# EAGLE design H0FR72 (EAGLE 9.6.1)

## Sheet 1 of 2
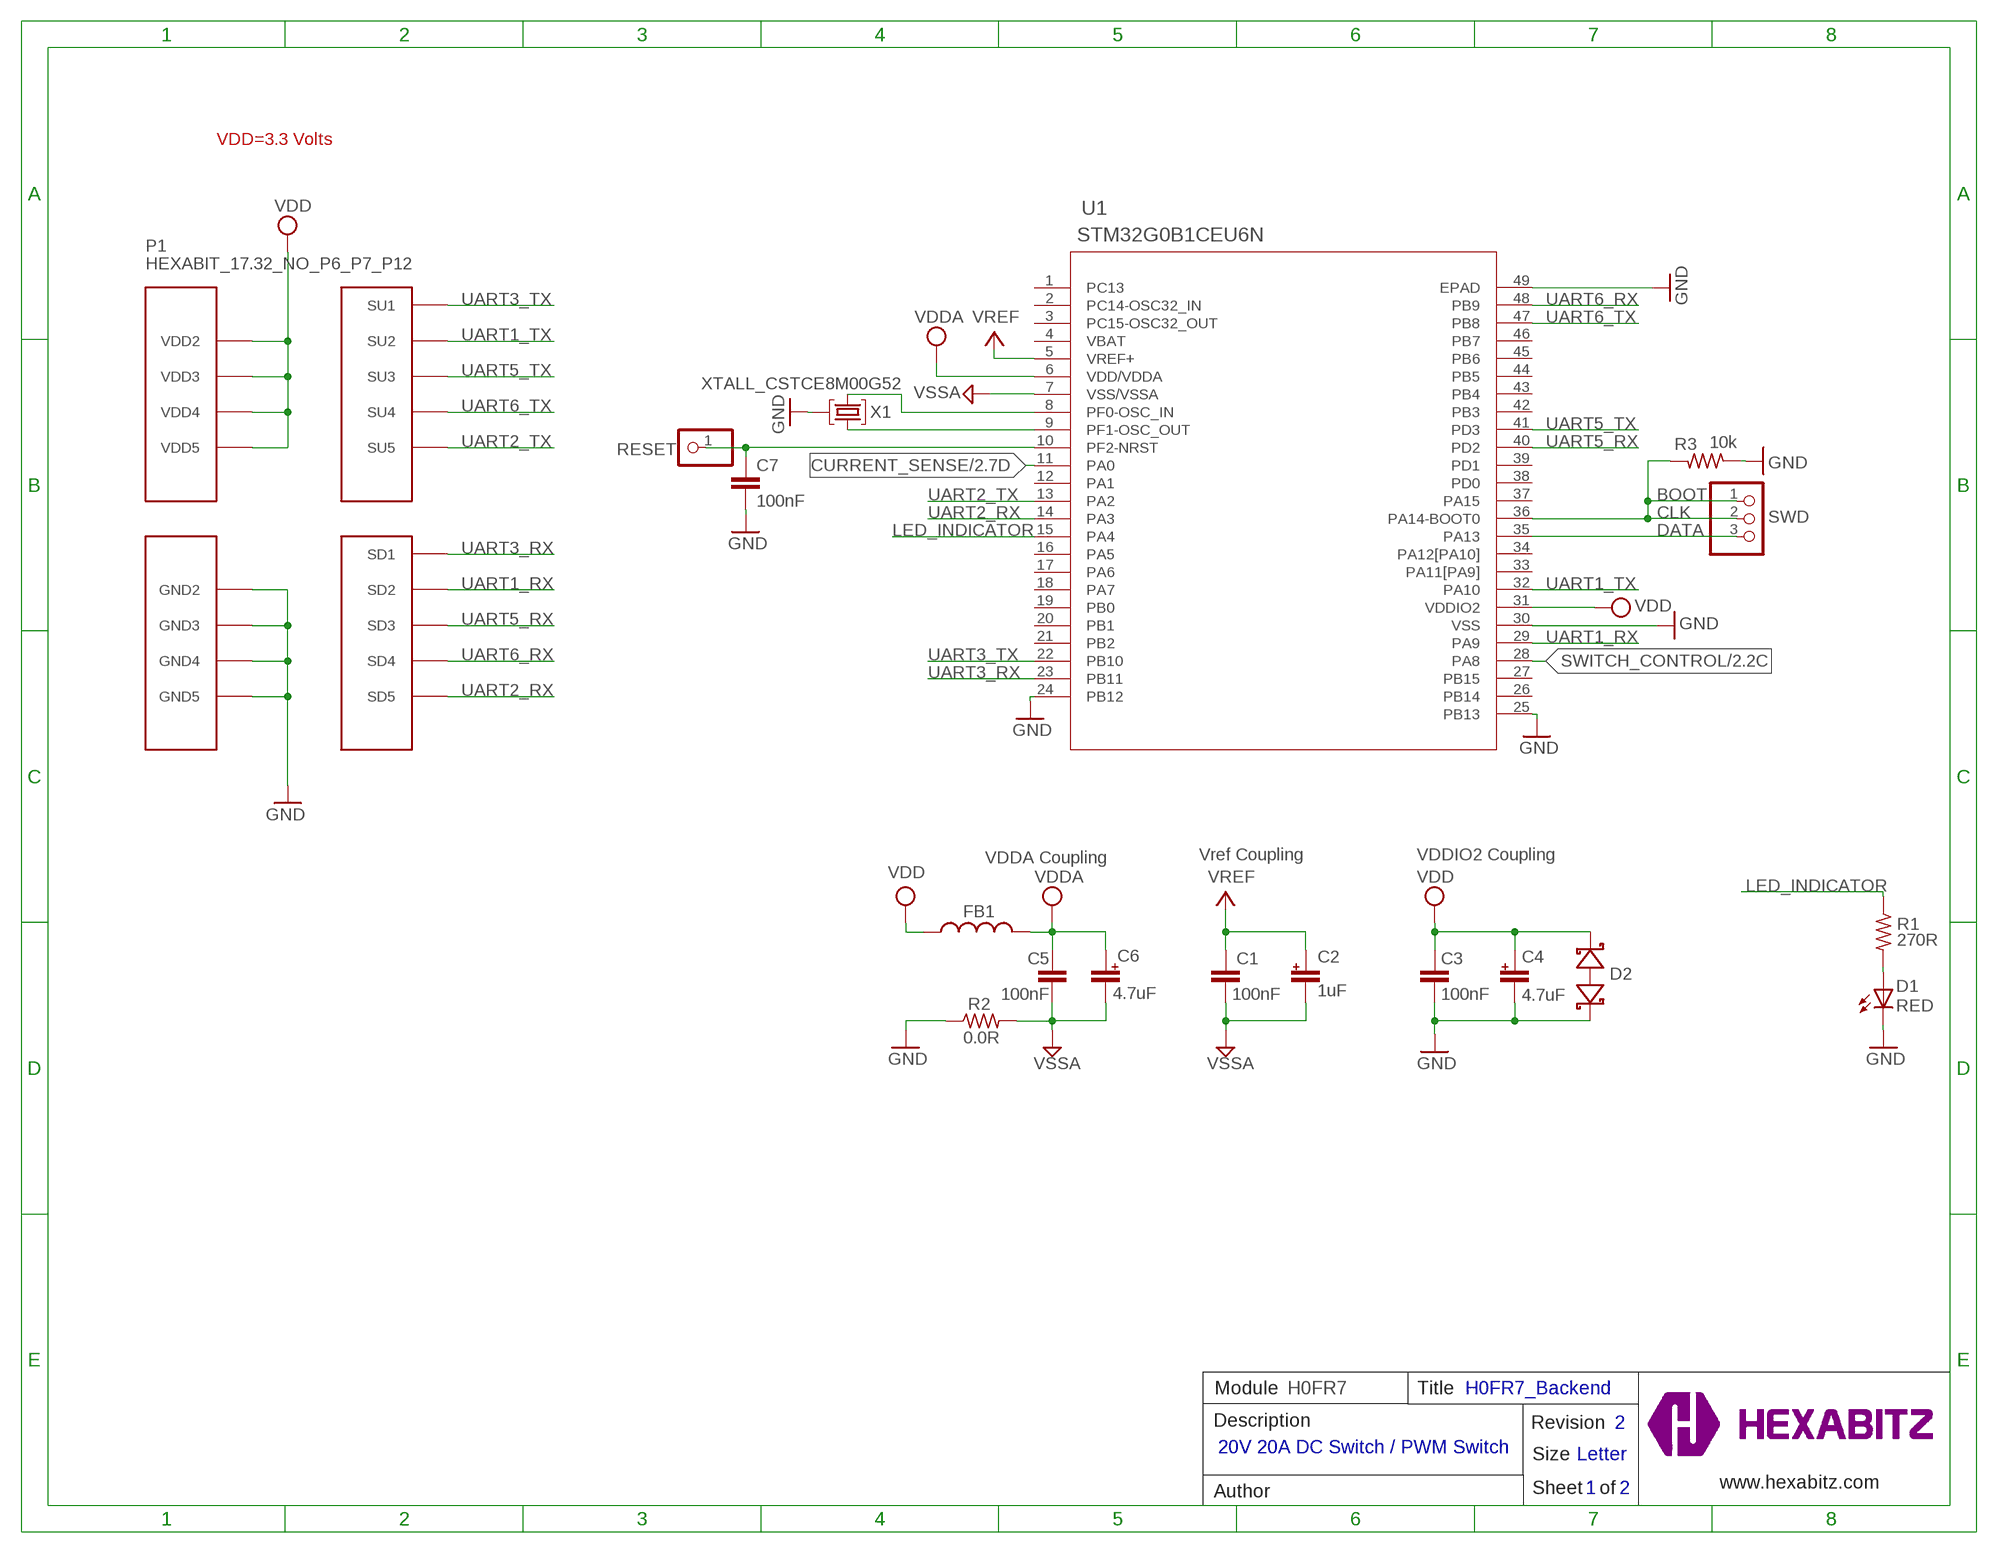
[diagram p0: schematic, sheet 1]

### Parts
C1  100nF  C-0402  [C-0402]
C2  1uF  C-0603-POL  [C-0603-POL]
C3  100nF  C-0402  [C-0402]
C4  4.7uF  C-0603-POL  [C-0603-POL]
C5  100nF  C-0603  [C-0603]
C6  4.7uF  C-0603-POL  [C-0603-POL]
C7  100nF  C-0402  [C-0402]
D1  RED  VLMS1300-GS08  [VLMS1300-GS08]
D2  BOURNS_CDSOD323-T03SCBOURNS_CDSOD323-T03SC_0_0  [BOURNS_CDSOD323-T03SC_0]
FB1  FB-0603  [FB-0603]
P1  HEXABIT_17.32_NO_P6_P7_P12  [HEXABIT_17.32_NO_P6_P7_P12]
R1  270R  R-0603  [R-0603]
R2  0.0R  R-0603  [R-0603]
R3  10k  R-0402  [R-0402]
RESET  R  PINHD-1X1  [1X01]
SWD  PINHD-1X3SWD  [SWD]
TRIMBLE-LOGO2  HEXA-LOGO  [HEXA-LOGO]
U1  STM32G0B1CEU6N  [HEXABITZ_ICS_QFN_B1CEU6_STM-L]
X1  XTALL_CSTCE8M00G52  [XTALL_CSTCE8M00G52]

### Nets
CLK: R3.2 SWD.1 SWD.2 U1.36(PA14-BOOT0)
CURRENT_SENSE: U1.11(PA0) ; also sheet 2
DATA: SWD.3 U1.35(PA13)
GND: C3.2 C4.2 C7.2 D1.C D2.2(C) P1.PAD_PD8(GND2) P1.PAD_PD9(GND3) P1.PAD_PD10(GND4) P1.PAD_PD11(GND5) R2.1 R3.1 U1.24(PB12) U1.25(PB13) U1.30(VSS) U1.49(EPAD) X1.P$2
LED_INDICATOR: R1.1 U1.15(PA4)
N$1: U1.9(PF1-OSC_OUT) X1.P$3
N$2: U1.8(PF0-OSC_IN) X1.P$1
N$4: D1.A R1.2
N$5: C7.1 RESET.1 U1.10(PF2-NRST)
SWITCH_CONTROL: U1.28(PA8) ; also sheet 2
UART1_RX: P1.PAD_PD2(SD2) U1.29(PA9)
UART1_TX: P1.PAD_PU2(SU2) U1.32(PA10)
UART2_RX: P1.PAD_PD5(SD5) U1.14(PA3)
UART2_TX: P1.PAD_PU5(SU5) U1.13(PA2)
UART3_RX: P1.PAD_PD1(SD1) U1.23(PB11)
UART3_TX: P1.PAD_PU1(SU1) U1.22(PB10)
UART5_RX: P1.PAD_PD3(SD3) U1.40(PD2)
UART5_TX: P1.PAD_PU3(SU3) U1.41(PD3)
UART6_RX: P1.PAD_PD4(SD4) U1.48(PB9)
UART6_TX: P1.PAD_PU4(SU4) U1.47(PB8)
VDD: C3.1 C4.1 D2.1(A) FB1.1 P1.PAD_PU8(VDD2) P1.PAD_PU9(VDD3) P1.PAD_PU10(VDD4) P1.PAD_PU11(VDD5) U1.31(VDDIO2)
VDDA: C5.1 C6.1 FB1.2 U1.6(VDD/VDDA)
VREF: C1.1 C2.1 U1.5(VREF+)
VSSA: C1.2 C2.2 C5.2 C6.2 R2.2 U1.7(VSS/VSSA) ; also sheet 2
Unconnected: U1.1(PC13) U1.2(PC14-OSC32_IN) U1.3(PC15-OSC32_OUT) U1.12(PA1) U1.16(PA5) U1.17(PA6) U1.18(PA7) U1.19(PB0) U1.20(PB1) U1.21(PB2) U1.26(PB14) U1.27(PB15) U1.33(PA11[PA9]) U1.34(PA12[PA10]) U1.37(PA15) U1.38(PD0) U1.39(PD1) U1.42(PB3) U1.43(PB4) U1.44(PB5) U1.45(PB6) U1.46(PB7)

### Notes on the sheet
- VDD=3.3 Volts
- BOOT
- VDDA Coupling | Vref Coupling | VDDIO2 Coupling
- Module | H0FR7 | Title | H0FR7_Backend
- Description | Revision | 2
- 20V 20A DC Switch / PWM Switch
- Size | Letter
- www.hexabitz.com
- Author | Sheet   of | 1 | 2
- C:/Users/Admin/Desktop/logodraft.bmp

## Sheet 2 of 2
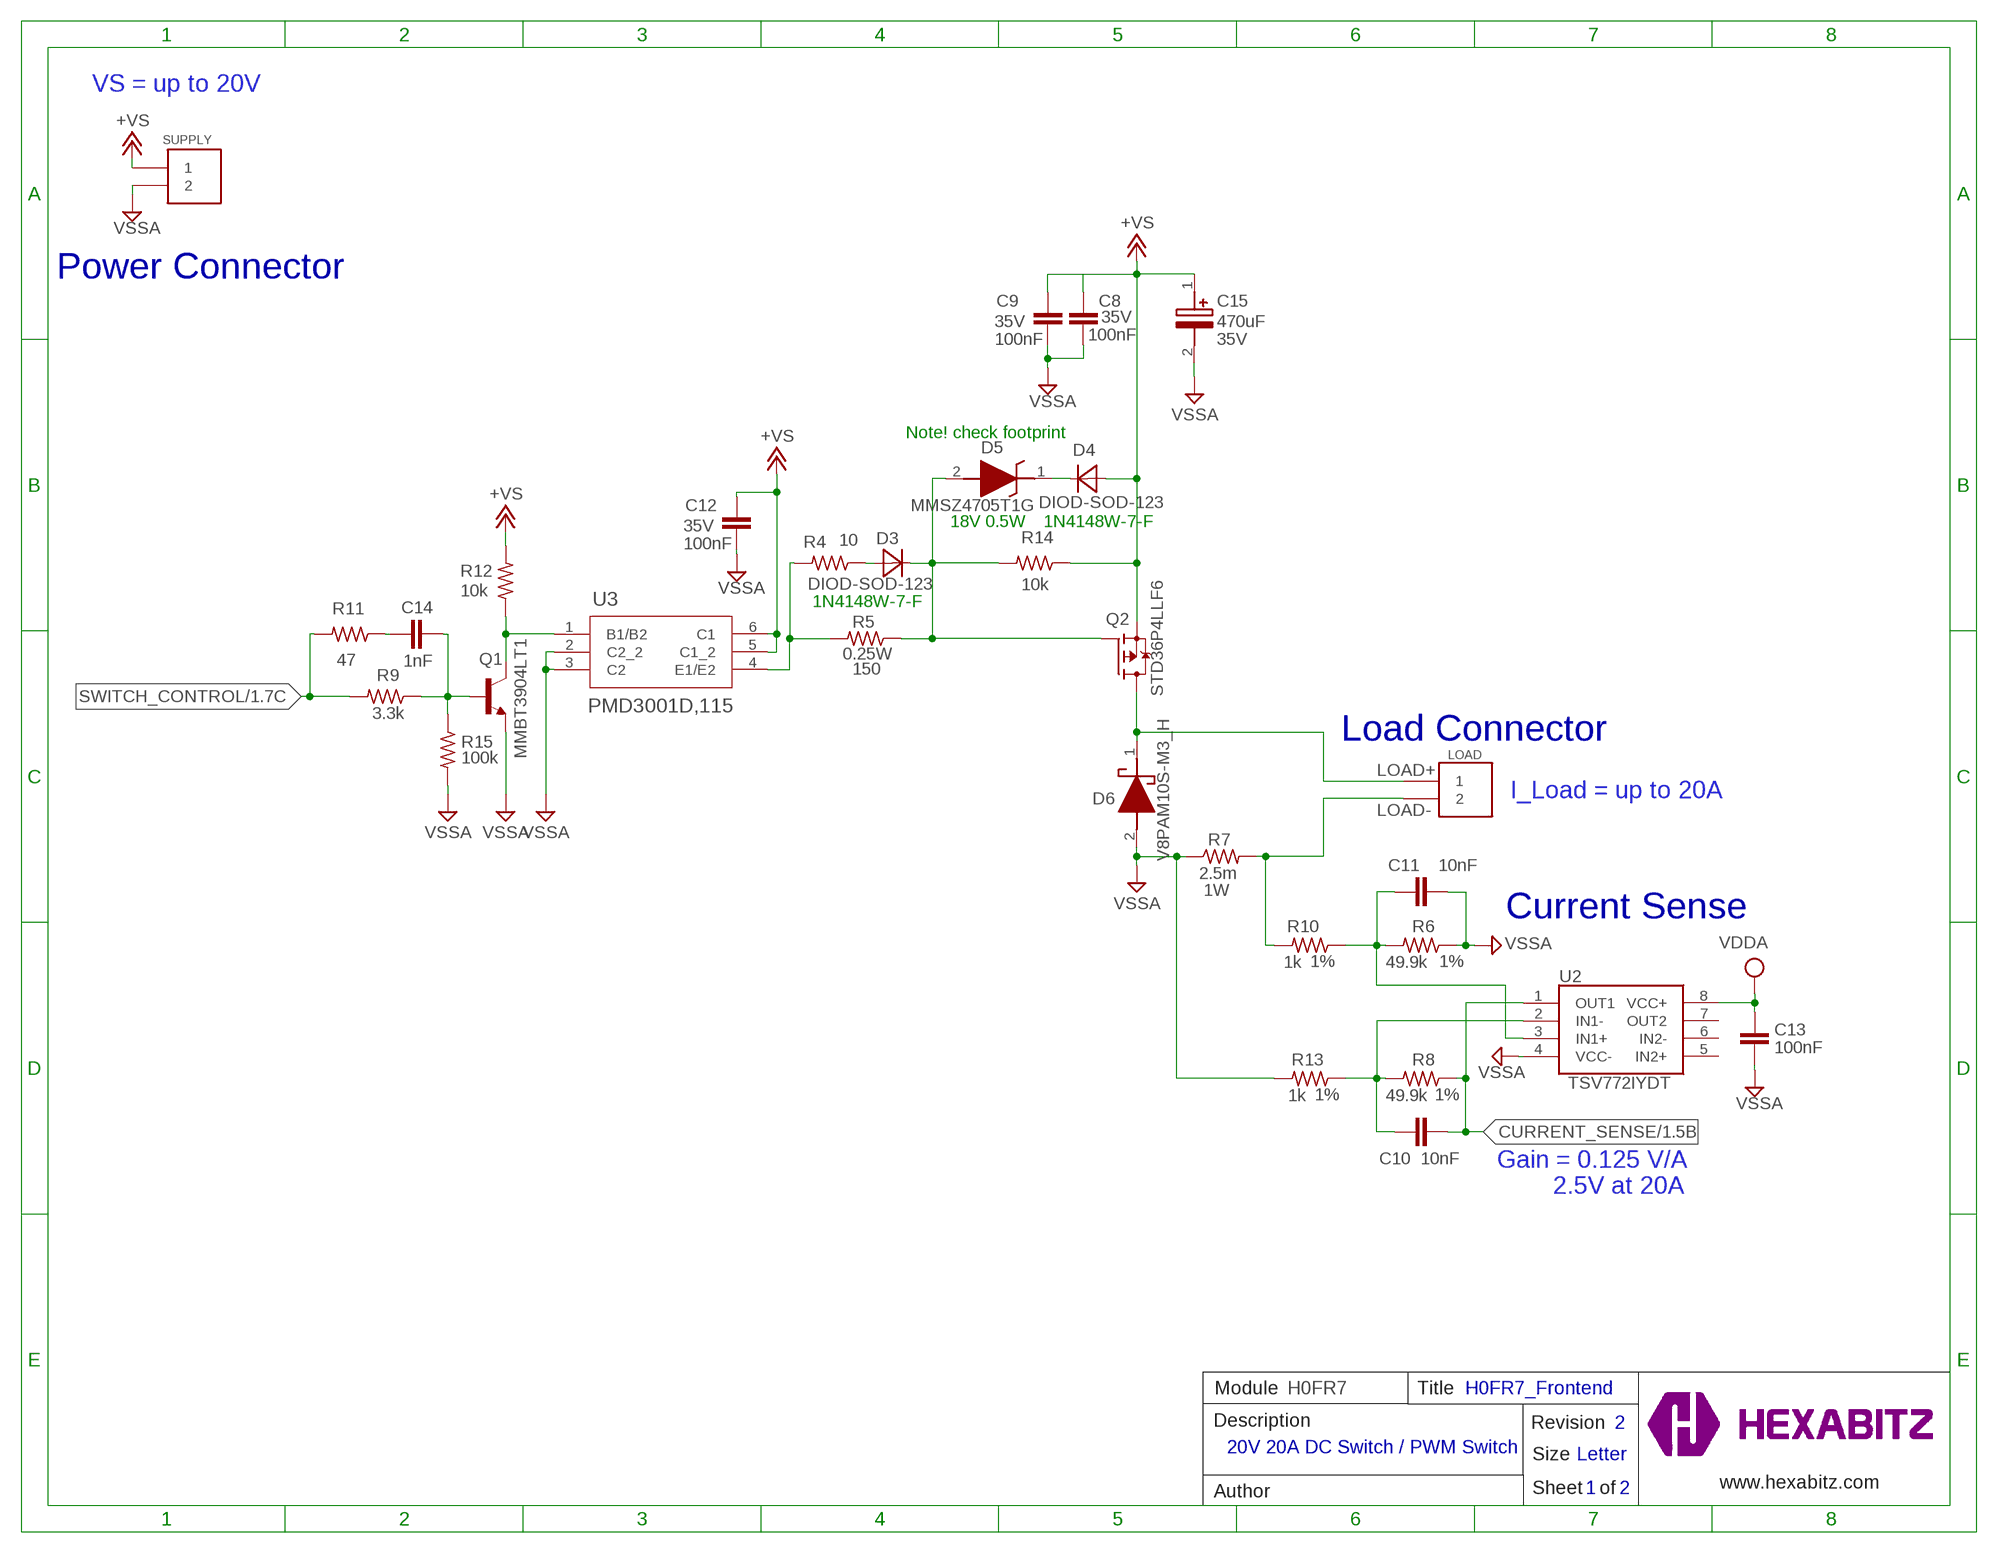
[diagram p1: schematic, sheet 2]

### Parts
C8  C-0402  [C-0402]
C9  C-0402  [C-0402]
C10  10nF  C-0402  [C-0402]
C11  10nF  C-0402  [C-0402]
C12  C-0402  [C-0402]
C13  100nF  C-0402  [C-0402]
C14  1nF  C-0402  [C-0402]
C15  ESH477M035AH3AA  [CAPPRD500W60D1000H1700]
D3  DIOD-SOD-123  [SOD123]
D4  DIOD-SOD-123  [SOD123]
D5  MMSZ4705T1G  [SOD3716X135N]
D6  V8PAM10S-M3_H  [V8PAM10SHM3H]
LOAD  1546111-2  [1546111-2]
Q1  MMBT3904LT1  [MMBT3904LT1]
Q2  STD36P4LLF6  [DPAK-3]
R4  10  R-0402  [R-0402]
R5  150  R-0402  [R-0402]
R6  49.9k  R-0402  [R-0402]
R7  2.5m  R-US_R2512  [R2512]
R8  49.9k  R-0402  [R-0402]
R9  3.3k  R-0402  [R-0402]
R10  1k  R-0402  [R-0402]
R11  47  R-0402  [R-0402]
R12  10k  R-0402  [R-0402]
R13  1k  R-0402  [R-0402]
R14  10k  R-0402  [R-0402]
R15  100k  R-0402  [R-0402]
SUPPLY  1546111-2  [1546111-2]
TRIMBLE-LOGO1  HEXA-LOGO  [HEXA-LOGO]
U2  TSV772IYDT  [SOIC127P600X175-8N]
U3  PMD3001D,115  PMD3001DSOT457_NEX  [SOT457_NEX]

### Nets
+VS: C8.2 C9.2 C12.2 C15.1(+) D4.1(A) Q2.3(S) R12.2 R14.1 SUPPLY.1 U3.5(C1_2) U3.6(C1)
CURRENT_SENSE: C10.2 R8.1 U2.1(OUT1) ; also sheet 1
LOAD+: D6.1(K) LOAD.1 Q2.4(D)
LOAD-: LOAD.2 R7.2 R10.2
N$3: Q1.3(C) R12.1 U3.1(B1/B2)
N$6: C11.1 R6.2 R10.1 U2.3(IN1+)
N$8: D4.2(C) D5.1(K)
N$9: C10.1 R8.2 R13.1 U2.2(IN1-)
N$13: D3.1(A) R4.1
N$14: C14.2 Q1.1(B) R9.1 R15.1
N$15: C14.1 R11.1
N$16: R4.2 R5.2 U3.4(E1/E2)
N$19: D3.2(C) D5.2(A) Q2.1(G) R5.1 R14.2
SWITCH_CONTROL: R9.2 R11.2 ; also sheet 1
VCC: C13.2 U2.8(VCC+) ; supply symbol labelled VDDA
VSSA: C8.1 C9.1 C11.2 C12.1 C13.1 C15.2(-) D6.2(A) Q1.2(E) R6.1 R7.1 R13.2 R15.2 SUPPLY.2 U2.4(VCC-) U3.2(C2_2) U3.3(C2) ; also sheet 1
Unconnected: U2.5(IN2+) U2.6(IN2-) U2.7(OUT2)

### Notes on the sheet
- VS = up to 20V
- Power Connector
- Note! check footprint
- 18V 0.5W | 1N4148W-7-F
- 1N4148W-7-F
- Load Connector
- I_Load = up to 20A
- Current Sense
- Gain = 0.125 V/A
          2.5V at 20A
- Module | H0FR7 | Title | H0FR7_Frontend
- Description | Revision | 2
- 20V 20A DC Switch / PWM Switch
- Size | Letter
- www.hexabitz.com
- Author | Sheet   of | 1 | 2

## Power pins joined to a net without a drawn wire
VBAT: U1.4(VBAT)

## Library data of the parts
C1 C3 C7 C14 = HEXABITZ_RCLS:C-0402: CAP CER 10% 0402; CAPACITANCE: 100nF; MFN: KEMET; MPN: C0603C104K8RACTU; OCTOPART_URL: https://octopart.com/c0603c104k8ractu-kemet-145075?r=sp&s=9bS9ASSwSEqMCE9KBEQZ0g; TOLERANCE: 10%; VOLTAGE_RATING: 10V
C2 = HEXABITZ_RCLS:C-0603-POL; CAPACITANCE: 1.00uF; MFN: Yageo; MPN: CC0805KKX7R7BB105; OCTOPART_URL: https://octopart.com/cc0805kkx7r7bb105-yageo-8376555?r=sp&s=YKl1wwtkROau_X5nniH2ig; TOLERANCE: 10%; VOLTAGE_RATING: 16V
C4 C6 = HEXABITZ_RCLS:C-0603-POL; CAPACITANCE: 4.7uF; MFN: Murata; MPN: GRM21BC81E475KA12L; OCTOPART_URL: https://octopart.com/grm21bc81e475ka12l-murata-10331911?r=sp&s=RY3qZSD8T6mG6TC9CHI5qQ; TOLERANCE: 10%; VOLTAGE_RATING: 25V
C5 = HEXABITZ_RCLS:C-0603: CAP CER 10% X7R 0603
C8 C9 C12 = HEXABITZ_RCLS:C-0402: CAP CER 10% 0402; CAPACITANCE: 100nF; VOLTAGE_RATING: 35V
C10 C11 C13 = HEXABITZ_RCLS:C-0402: CAP CER 10% 0402; CAPACITANCE: 100nF; MFN: KEMET; MPN: C0603C104K8RACTU; OCTOPART_URL: https://octopart.com/c0603c104k8ractu-kemet-145075?r=sp&s=9bS9ASSwSEqMCE9KBEQZ0g; TOLERANCE: 10V; VOLTAGE_RATING: 10%
C15 = HEXABITZ_RCLS:ESH477M035AH3AA: Kemet 470uF Electrolytic Aluminium Electrolytic Capacitor 35V dc Through Hole - ESH477M035AH3AA Source: Datasheet <https://www.arrow.com/en/products/esh477m035ah3aa/kemet-corporation>; CAPACITANCE: 470uF; DESCRIPTION: Kemet 470uF Electrolytic Aluminium Electrolytic Capacitor 35V dc Through Hole - ESH477M035AH3AA; HEIGHT: 17mm; MANUFACTURER_NAME: KEMET; MANUFACTURER_PART_NUMBER: ESH477M035AH3AA; MOUSER_PART_NUMBER: 80-ESH477M035AH3AA; MOUSER_PRICE-STOCK: https://www.mouser.co.uk/ProductDetail/KEMET/ESH477M035AH3AA?qs=w9hhVRgtvfm6jijrpCvP%2Fg%3D%3D; VOLT_RATING: 35V
D1 = Hexabitz:VLMS1300-GS08: Red 0603 130° Clear 54 mcd 2 V Surface Mount ChipLED ; Octopart Url : http://octopart.com/vlms1300-gs08-vishay-21709201; MFN: Vishay; MPN: VLMS1300-GS08; OCTOPART_URL: https://octopart.com/vlms1300-gs08-vishay-21709201?r=sp&s=_gcP4_q8T1SC6PJQPTQ9yA
D2 = HEXABITZ_RCLS:BOURNS_CDSOD323-T03SC: CDSOD323-TxxSC - TVS Diode Series; DESCRIPTION: Dio Tvs Vwm 03V 500W Bidir Sod323 / Tape & Reel - 7" Reel; MFN: Bourns; MPN: CDSOD323-T03SC; OCTOPART_URL: https://octopart.com/cdsod323-t03sc-bourns-10487153?r=sp
D3 D4 = HEXABITZ_RCLS:DIOD-SOD-123: 1.0 A Surface Mount Schottky Barrier Rectifier, 40 V, -65 to 125 degC, 2-Pin SOD-123 Package, RoHS, Tape and Reel
D5 = HEXABITZ_RCLS:MMSZ4705T1G: 18 V Low Current ZenerDiodeVoltage Regulator Source: Datasheet <http://www.onsemi.com/pub/Collateral/MMSZ4678T1-D.PDF>; DESCRIPTION: 18 V Low Current ZenerDiodeVoltage Regulator; HEIGHT: 1.35mm; MANUFACTURER_NAME: onsemi; MANUFACTURER_PART_NUMBER: MMSZ4705T1G; MOUSER_PART_NUMBER: 863-MMSZ4705T1G; MOUSER_PRICE-STOCK: https://www.mouser.co.uk/ProductDetail/onsemi/MMSZ4705T1G?qs=P4IOph%252Bbot%252B1wya9Eg73HA%3D%3D
D6 = HEXABITZ_RCLS:V8PAM10S-M3_H: Schottky Diodes & Rectifiers 8A 100V Source: Datasheet <https://www.vishay.com/docs/87013/v8pam10s.pdf>; DESCRIPTION: Schottky Diodes & Rectifiers 8A 100V; HEIGHT: 1mm; MANUFACTURER_NAME: Vishay; MANUFACTURER_PART_NUMBER: V8PAM10S-M3/H; MOUSER_PART_NUMBER: 78-V8PAM10S-M3/H; MOUSER_PRICE-STOCK: https://www.mouser.co.uk/ProductDetail/Vishay-General-Semiconductor/V8PAM10S-M3-H?qs=7MVldsJ5Uazp%2FkF6tV7Ktw%3D%3D
FB1 = HEXABITZ_RCLS:FB-0603: Ferrite Beads Multi-Layer 0603
LOAD SUPPLY = HEXABITZ_CONNECTION_PARTS:1546111-2: Conn Shrouded Header HDR 2 POS 5.08mm Solder ST Thru-Hole; MFN: TE Connectivity; MPN: 1546111-2; OCTOPART_URL: https://octopart.com/1546111-2-te+connectivity-40393355
P1 = hexabitz_connectors:HEXABIT_?_NO_P6_P7_P12: Hexabitz Hexagon Module Connector Hexagon side length = 17.32mm. The following ports are removed: P6 P7 P12
Q1 = HEXABITZ_RCLS:MMBT3904LT1: TRANS NPN 40V 0.2A SOT23; MOUNTING_STYLE: Surface Mount; NUM_OF_PINS: 3; PACKAGE: SOT-23-3; PACKAGING: Reel; PRODUCT_CATEGORY: Transistors Bipolar-BJT; SERIES: MMBT3904L
Q2 = HEXABITZ_RCLS:STD36P4LLF6: P-channel 40 V, 0.0175 Ω typ.,36 A, STripFET™ F6 Power MOSFET in a DPAK package; DISCRIPTION: P-channel 40 V, 0.0175 Ohm typ., 36 A STripFET F6 in a DPAK package; MFN: STMicroelectronics; MPN: STD36P4LLF6; OCTOPART_URL: https://octopart.com/std36p4llf6-stmicroelectronics-34425371?r=sp
R1 R2 = HEXABITZ_RCLS:R-0603: Thick Film Resistors - SMD 0603
R3 R12 = HEXABITZ_RCLS:R-0402: Thick Film Resistors - SMD 0603; MFN: Yageo; MPN: RC0603JR-0710KL; OCTOPART_URL: https://octopart.com/search?q=RC0603JR-0710KL&start=0; RESISTANCE: 10.0K Ohm; TOLERANCE: 5%
R4 R9 R11 R14 R15 = HEXABITZ_RCLS:R-0402: Thick Film Resistors - SMD 0603; MFN: Yageo; MPN: RC0603JR-07680KL; OCTOPART_URL: https://octopart.com/rc0603jr-07680kl-yageo-40953169?r=sp; RESISTANCE: 680K Ohm; TOLERANCE: 5%
R5 = HEXABITZ_RCLS:R-0402: Thick Film Resistors - SMD 0603; MFN: Yageo; MPN: RC0603JR-07680KL; OCTOPART_URL: https://octopart.com/rc0603jr-07680kl-yageo-40953169?r=sp; POWER: 0.25W; RESISTANCE: 680K Ohm; TOLERANCE: 5%
R6 R8 R10 R13 = HEXABITZ_RCLS:R-0402: Thick Film Resistors - SMD 0603; MFN: Yageo; MPN: RC0603JR-071KL; OCTOPART_URL: https://octopart.com/rc0603jr-071kl-yageo-55402888?r=sp; RESISTANCE: 1k; TOLERANCE: 1%
R7 = HEXABITZ_RCLS:R-US_: RESISTOR, American symbol; POWER: 1W; SPICEPREFIX: R
RESET = HEXABITZ_USER_INTERFACE_PARTS:PINHD-1X1: PIN HEADER; MFN: TE Connectivity; MPN: 87227-1; OCTOPART_URL: https://octopart.com/87227-1-te+connectivity-39512052?r=sp
SWD = HEXABITZ_CONNECTION_PARTS:PINHD-1X3: PIN HEADER
TRIMBLE-LOGO1 TRIMBLE-LOGO2 = HEXABITZ_USER_INTERFACE_PARTS:HEXA-LOGO: Trimble-Logo
U1 = HEXABITZ_ICs:STM32G0B1CEU6N
U2 = HEXABITZ_ICs:TSV772IYDT: High bandwidth (20MHz) Low offset (200 µV) rail-to-rail 5V Op amp Source: Datasheet <https://www.st.com/resource/en/datasheet/tsv772.pdf>; DESCRIPTION: High bandwidth (20MHz) Low offset (200 &#181;V) rail-to-rail 5V Op amp; HEIGHT: 1.75mm; MANUFACTURER_NAME: STMicroelectronics; MANUFACTURER_PART_NUMBER: TSV772IYDT
U3 = HEXABITZ_ICs:PMD3001D; COPYRIGHT: Copyright (C) 2022 Ultra Librarian. All rights reserved.; MANUFACTURER_PART_NUMBER: PMD3001D; MFR_NAME: Nexperia
X1 = HEXABITZ_OTHER_PARTS:XTALL_CSTCE8M00G52: MURATA CSTCE8M00G52-R0 RESONATOR, SMD, 8MHZ ; Octopart Url : https://octopart.com/cstce8m00g52-r0-murata-7145559; MFN: Murata; MPN: CSTCE8M00G52Z-R0; OCTOPART_URL: https://octopart.com/cstce8m00g52z-r0-murata-17755941?r=sp&s=JDnNJnrHQhyS8Zk4ofFWXw

## Board
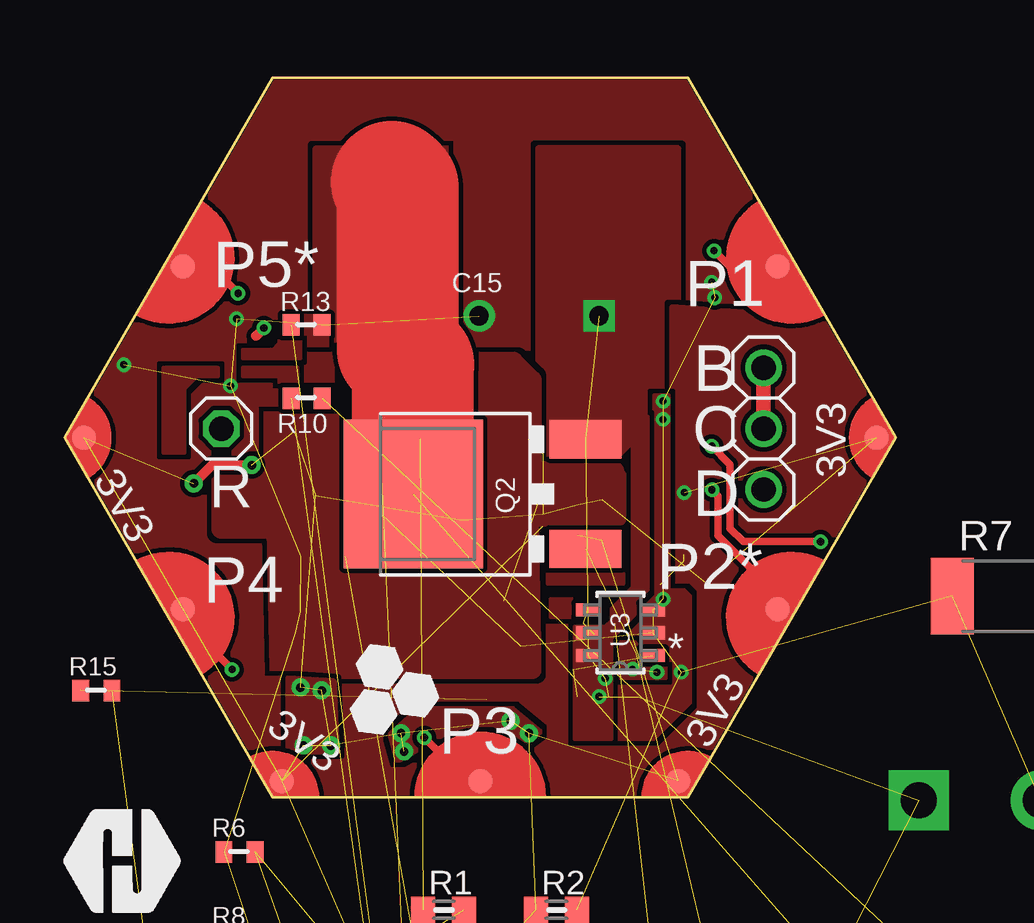
[diagram p2: board, top side]
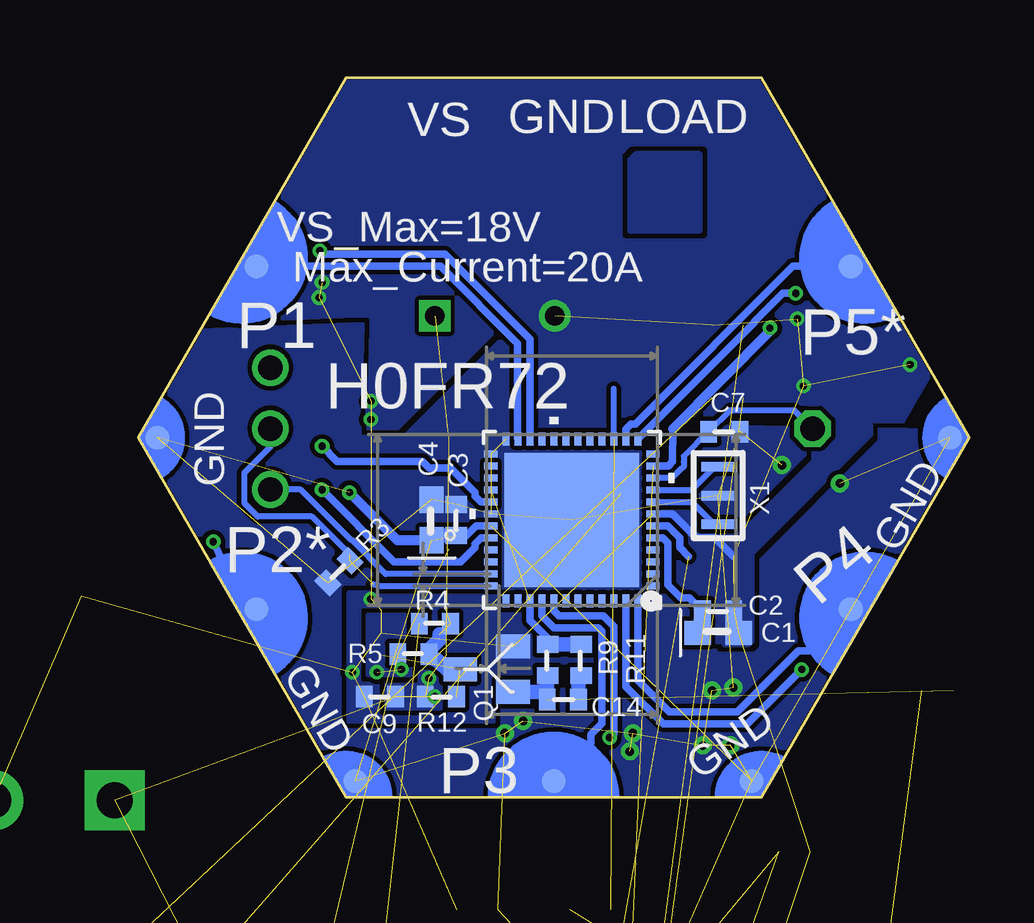
[diagram p3: board, bottom side, seen from below]

Size 34.64 x 30 mm. Coordinates in mm from the lower left corner, seen from the top.
Copper layers (1*16): Top 0.035mm / dielectric 1.5mm / Bottom 0.035mm
Design rules "default": minimum track width 6mil, minimum drill 0.3mm, track to track 7.5mil, track to pad 7.5mil, pad to pad 7.5mil, via to via 7.5mil, smd to smd 0mil, copper to edge 1mil, drill to drill 6mil, minimum pad ring 10mil, minimum via ring 6mil, stop-mask expansion 4mil, vias tented up to drill 24mil, thermal gap 10mil

### Footprints (pad centres in the part's own frame; a part is rotated, then mirrored left to right if it is on the bottom)
C-0402 = smd 0.7 x 0.9: 1 -0.65,0; 2 0.65,0
C-0603-POL = smd 1.1 x 1: 1 -0.85,0; 2 0.85,0
C-0603 = smd 1.1 x 1: 1 -0.85,0; 2 0.85,0
CAPPRD500W60D1000H1700 = drill 0.8 pad 1.2 square: 1 0,0 | drill 0.8 pad 1.2: 2 5,0
VLMS1300-GS08 = smd 0.8 x 0.8: A 0,0.75; C 0,-0.75
BOURNS_CDSOD323-T03SC_0 = smd 0.8 x 0.5: 1 -1.1,0; 2 1.1,0
SOD123 = smd 1.6 x 0.8: 1 -1.7,0; 2 1.7,0
SOD3716X135N = smd 1.15 x 0.8: 1 -1.75,0; 2 1.75,0
V8PAM10SHM3H = smd 3.1 x 2.2: 1 -1.095,0 | smd 1.5 x 1.52: 2 2.125,0
FB-0603 = smd 1 x 1.1: 1 -0.85,0; 2 0.85,0
1546111-2 = drill 1.5 pad 2.5 square: 1 -2.54,0 | drill 1.5 pad 2.5: 2 2.54,0
HEXABIT_17.32_NO_P6_P7_P12 = smd 1 x 1 bottom: PAD_PD1 12.39,7.15; PAD_PD2 12.39,-7.15; PAD_PD3 0,-14.31; PAD_PD4 -12.39,-7.15; PAD_PD5 -12.39,7.15; PAD_PD8 16.52,0; PAD_PD9 8.26,-14.31; PAD_PD10 -8.26,-14.31; PAD_PD11 -16.52,0 | smd 1 x 1: PAD_PU1 12.39,7.15; PAD_PU2 12.39,-7.15; PAD_PU3 0,-14.31; PAD_PU4 -12.39,-7.15; PAD_PU5 -12.39,7.15; PAD_PU8 16.52,0; PAD_PU9 8.26,-14.31; PAD_PU10 -8.26,-14.31; PAD_PU11 -16.52,0
MMBT3904LT1 = smd 1 x 1.4: 1 -0.95,-1.1; 2 0.95,-1.1; 3 0,1.1
DPAK-3 = smd 1.6 x 3: 1 -2.286,-7.18; 3 2.286,-7.18 | smd 6.2 x 5.8: 4 0,0
R-0603 = smd 1 x 1.1: 1 -0.85,0; 2 0.85,0
R-0402 = smd 0.7 x 0.9: 1 -0.65,0; 2 0.65,0
R2512 = smd 1.8 x 3.2: 1 -2.8,0; 2 2.8,0
1X01 = drill 1.016 octagon: 1 0,0
SWD = drill 1.016: 1 -2.54,0; 2 0,0; 3 2.54,0
HEXABITZ_ICS_QFN_B1CEU6_STM-L = smd 0.55 x 0.297: 1 -3.38,2.751; 2 -3.38,2.251; 3 -3.38,1.75; 4 -3.38,1.25; 5 -3.38,0.75; 6 -3.38,0.25; 7 -3.38,-0.25; 8 -3.38,-0.75; 9 -3.38,-1.25; 10 -3.38,-1.75; 11 -3.38,-2.251; 12 -3.38,-2.751; 25 3.38,-2.751; 26 3.38,-2.251; 27 3.38,-1.75; 28 3.38,-1.25; 29 3.38,-0.75; 30 3.38,-0.25; 31 3.38,0.25; 32 3.38,0.75; 33 3.38,1.25; 34 3.38,1.75; 35 3.38,2.251; 36 3.38,2.751 | smd 0.297 x 0.55: 13 -2.751,-3.38; 14 -2.251,-3.38; 15 -1.75,-3.38; 16 -1.25,-3.38; 17 -0.75,-3.38; 18 -0.25,-3.38; 19 0.25,-3.38; 20 0.75,-3.38; 21 1.25,-3.38; 22 1.75,-3.38; 23 2.251,-3.38; 24 2.751,-3.38; 37 2.751,3.38; 38 2.251,3.38; 39 1.75,3.38; 40 1.25,3.38; 41 0.75,3.38; 42 0.25,3.38; 43 -0.25,3.38; 44 -0.75,3.38; 45 -1.25,3.38; 46 -1.75,3.38; 47 -2.251,3.38; 48 -2.751,3.38 | smd 5.6 x 5.6: 49 0,0
SOIC127P600X175-8N = smd 1.525 x 0.65: 1 -2.712,1.905; 2 -2.712,0.635; 3 -2.712,-0.635; 4 -2.712,-1.905; 5 2.712,-1.905; 6 2.712,-0.635; 7 2.712,0.635; 8 2.712,1.905
SOT457_NEX = smd 1.003 x 0.55: 1 -1.353,0.95; 2 -1.353,0; 3 -1.353,-0.95; 4 1.353,-0.95; 5 1.353,0; 6 1.353,0.95
XTALL_CSTCE8M00G52 = smd 1.4 x 0.4: P$1 0,1.2; P$2 0,0; P$3 0,-1.2

### Placement (x,y rotation side)
C1  10.46,7.76 0 bottom
C2  10.46,6.87 0 bottom
C3  21.38,11.57 90 bottom
C4  22.4,11.57 90 bottom
C5  5.64,-19.8 0 top  (outside the outline)
C6  10.46,-16.24 0 top  (outside the outline)
C7  10.21,15.25 0 bottom
C8  31.8,-23.73 0 top  (outside the outline)
C9  24.56,4.2 0 bottom
C10  7.16,-10.02 0 top  (outside the outline)
C11  31.8,-30.09 0 top  (outside the outline)
C12  31.8,-26.91 0 top  (outside the outline)
C13  31.8,-34.66 0 top  (outside the outline)
C14  16.94,4.08 180 bottom
C15  22.27,20.08 0 bottom
D1  2.46,-14.21 0 top  (outside the outline)
D2  11.1,-12.69 0 top  (outside the outline)
D3  27.1,-14.97 0 top  (outside the outline)
D4  24.05,-29.45 0 top  (outside the outline)
D5  23.8,-25.26 0 top  (outside the outline)
D6  3.73,-24.88 0 top  (outside the outline)
FB1  14.27,-9.26 0 top  (outside the outline)
LOAD  38.15,-11.42 0 top  (outside the outline)
P1  17.32,15 0 top
Q1  20.11,5.35 90 bottom
Q2  14.53,12.65 90 top
R1  15.8,-4.69 0 top  (outside the outline)
R2  20.5,-4.69 0 top  (outside the outline)
R3  26.27,9.41 45 bottom
R4  22.27,7.25 0 bottom
R5  23.16,5.98 0 bottom
R6  7.29,-2.27 0 top
R7  39.8,8.4 0 top
R8  7.29,-5.96 0 top  (outside the outline)
R9  17.57,5.73 90 bottom
R10  10.08,16.65 0 top
R11  16.18,5.73 90 bottom
R12  22.02,4.2 180 bottom
R13  10.08,19.7 0 top
R14  25.83,-20.56 0 top  (outside the outline)
R15  1.32,4.46 0 top
RESET  6.53,15.38 0 top
SUPPLY  38.15,-0.11 0 top
SWD  29.13,15.38 270 top
TRIMBLE-LOGO1  2.46,-10.15 0 top  (outside the outline)
TRIMBLE-LOGO2  2.46,-4.81 0 top  (outside the outline)
U1  16.56,11.57 180 bottom
U2  17.32,-20.43 0 top  (outside the outline)
U3  23.16,6.87 180 top
X1  10.46,12.59 180 bottom

### Tracks (layer width: path | path; a pad name or v marks a point on that pad's centre or on a via)
+VS  (via drill 0.3 pad 0.55)  (12 unrouted)
  other vias: 22.53,4.97 22.27,4.2
  pour Top (rank 5, no thermals): 20.24,14.11 22.91,14.11 25.58,16.78 25.58,27.06 19.73,27.06 19.73,14.62
  pour Top (no thermals): 21.26,7.13 21.26,2.43 22.78,2.43 22.78,6.62 23.8,7.63 23.8,8.14 24.3,8.65 24.3,15.89 23.67,15.89 23.67,8.78 22.78,7.89 22.78,7.38 22.53,7.13
  pour Bottom (rank 3, no thermals): 24.3,3.7 22.02,3.7 22.02,5.35 22.78,5.35 22.91,5.22 22.91,4.71 24.3,4.71
CLK  (2 unrouted)
  Top 0.61: SWD.2 SWD.1
  Bottom 0.254: 24.83,8.89 24.68,8.89 24.62,8.82 U1.36 | 25.81,10.13 27.39,11.71 29.65,11.71 30.21,12.27 30.21,13.54 29.13,14.62 SWD.2
CS
  pour Top (rank 2, no thermals): 18.72,18.18 8.68,18.18 8.68,13.22 6.53,13.22 6.53,11.19 8.81,11.19 8.94,5.35 19.48,5.35 19.35,11.7 23.04,11.7 23.04,13.35 22.91,13.35 22.91,13.6 19.48,13.6 19.48,17.41
CURRENT_SENSE  (via drill 0.3 pad 0.55)  (3 unrouted)
  Top 0.406: 7.97,19.24 v8.3,19.57
  Bottom 0.305: 12.34,15.36 12.37,14 12.54,13.82 U1.11
  Bottom 0.406: v8.3,19.57 8.3,19.45 12.34,15.36
DATA
  Bottom 0.254: U1.35 24.32,9.32 25.75,10.75 25.77,10.75 27.86,12.84 SWD.3
GND  (via drill 0.35 pad 0.75)  (24 unrouted)
  Top 0.406: v5.38,13.09 6.14,13.86 v7.79,13.86
  other vias: 11.1,2.17 9.95,2.17 9.83,4.59 10.72,4.46 14.14,1.92 14.02,2.68 19.35,2.68 18.59,3.19
  pour Bottom (rank 5, no thermals): 34.72,15.13 32.04,19.44 25.32,19.72 25.45,15 23.54,15 19.48,19.06 14.4,19.06 14.53,15.51 0.18,15.25 0.05,15 8.61,0.14 26.03,0.14
  pour Top (no thermals): 9.32,4.97 9.32,1.92 11.35,1.92 11.22,4.84
  pour Top (no thermals): 13.89,1.54 13.59,2.64 14.77,3.7 18.65,3.7 19.81,2.74 19.28,2.34 17.83,3.06 15.92,2.68
LED_INDICATOR  (1 unrouted)
  Bottom 0.254: U1.15 14.81,17.04
LOAD+  (2 unrouted)
  Top 5.08: Q2.4 14.53,18.04 13.89,18.68 13.89,25.42 13.64,25.67
  pour Top (rank 2, no thermals): 16.05,27.06 16.05,19.06 10.46,19.06 10.46,27.06
  pour Bottom (rank 4, no thermals): 11.22,26.81 13.89,26.81 14.14,26.56 14.14,23.64 11.22,23.64
LOAD-  (2 unrouted)
N$1
  Bottom 0.254: X1.P$3 10.61,13.79 11.58,12.82 U1.9
N$2
  Bottom 0.254: X1.P$1 10.61,11.39 11.54,12.32 U1.8
N$3  (2 unrouted)
N$4  (1 unrouted)
N$5
  Bottom 0.254: U1.10 12.38,13.32 12.04,13.66 11.9,13.8 11.89,13.8 11.89,14 11.89,14.22 C7.1 9.97,16.14 7.29,16.14 RESET.1
N$6  (3 unrouted)
N$7  (via drill 0.3 pad 0.55)  (1 unrouted)
  other vias: 23.67,5.35 24.69,5.22
  pour Top (no thermals): 25.07,6.49 23.16,6.49 23.16,4.97 25.07,4.97
  pour Bottom (rank 3, no thermals): 25.07,7.63 23.29,7.63 23.29,5.09 25.07,5.09
N$8  (1 unrouted)
N$9  (3 unrouted)
N$10
  pour Top (no thermals): 20.11,11.19 20.11,8.9 23.29,8.9 23.29,11.19
N$11
  pour Top (no thermals): 7.41,17.92 9.7,17.92 9.7,16.27 8.94,16.27 8.94,17.54 7.41,17.54
N$12
  pour Top (no thermals): 20.24,8.27 20.24,7.51 22.4,7.51 22.4,8.27
N$13  (1 unrouted)
N$14  (1 unrouted)
  Bottom 0.61: R9.1 17.59,5.06 17.59,4.46 | 17.59,4.46 C14.2 | Q1.1 17.65,4.4 17.59,4.46
N$15
  Bottom 0.61: R11.1 16.29,4.97 C14.1
N$16  (2 unrouted)
  Bottom 0.61: 21.37,5.19 21.62,5.19 22.2,5.76 22.29,5.76 R5.2 22.51,6.16 22.08,6.6 22.08,6.8
N$18
  pour Top (no thermals): 7.41,18.68 7.41,18.3 9.83,18.3 9.83,20.08 9.19,20.08 8.94,19.83 8.94,18.94 8.68,18.68
N$19  (4 unrouted)
SWITCH_CONTROL  (1 unrouted)
  Bottom 0.305: R9.2 17.57,6.65 18.3,7.38 18.3,8.19
  Bottom 0.61: R9.2 R11.2
UART1_RX  (via drill 0.3 pad 0.55)
  Top 0.305: v31.51,10.67 28.29,10.67 27.73,11.22 27.73,13.88 v26.97,14.65
  Bottom 0.305: v26.97,14.65 26.34,14.01 22.78,14.01 22.5,13.73 21.61,13.73 20.59,12.71 20.59,12.57 20.35,12.32 U1.29 | P1.PAD_PD2 30.58,8.72 v31.51,10.67
UART1_TX  (via drill 0.3 pad 0.55)
  Top 0.305: P1.PAD_PU2 29.71,8.45 27.23,10.93 27.23,12.58 v26.98,12.83
  Bottom 0.305: U1.32 20.35,10.82 20.59,10.58 20.59,10.43 21.19,9.83 23.97,9.83 v26.98,12.83
UART2_RX
  Bottom 0.305: P1.PAD_PD5 7.34,22.15 13.92,15.57 14.1,15.57 14.31,15.36 U1.14
UART2_TX  (via drill 0.3 pad 0.55)
  Top 0.305: v7.23,21.02 6.1,22.15 5.51,22.15 P1.PAD_PU5
  Bottom 0.305: U1.13 8.95,19.81 8.95,19.84 7.77,21.02 v7.23,21.02
UART3_RX
  Bottom 0.305: U1.23 18.82,18.92 22.04,22.15 P1.PAD_PD1
UART3_TX  (via drill 0.3 pad 0.55)
  Top 0.305: P1.PAD_PU1 27.71,22.15 v27.07,22.79
  Bottom 0.305: v27.07,22.79 26.92,22.64 21.84,22.64 18.31,19.12 U1.22
UART5_RX
  Bottom 0.305: U1.40 17.8,7.58 17.3,7.08 15.46,7.08 15.3,6.92 15.3,3.1 15.76,2.64 15.76,2.25 P1.PAD_PD3
UART5_TX  (via drill 0.3 pad 0.55)
  Top 0.305: v14.99,2.49 16.79,0.69 P1.PAD_PU3
  Bottom 0.305: U1.41 17.3,8.18 17.3,7.77 17.1,7.57 15.25,7.57 14.8,7.13 14.8,2.68 v14.99,2.49
UART6_RX
  Bottom 0.305: U1.48 13.81,4.88 12.49,3.57 9.65,3.57 7.11,6.11 6.67,6.11 P1.PAD_PD4
UART6_TX  (via drill 0.3 pad 0.55)
  Top 0.305: v6.97,5.34 4.93,7.38 P1.PAD_PU4
  Bottom 0.305: U1.47 14.31,4.62 12.75,3.06 9.25,3.06 v6.97,5.34
VCC  (1 unrouted)
VDD  (via drill 0.3 pad 0.55)  (7 unrouted)
  Bottom 0.305: U1.31 20.55,11.32 20.95,10.92 C3.1
  Bottom 0.406: 22.53,10.72 23.84,10.72 v25.83,12.71
  Bottom 0.61: C3.1 22.33,10.92 22.53,10.72
  pour Top (rank 4, no thermals): 34.72,15.13 31.8,19.95 25.32,20.44 25.32,15.25 0.18,15.25 0.05,15 8.61,0.14 26.03,0.14
VDDA  (3 unrouted)
  Bottom 0.305: U1.6 12.56,11.32 12.07,10.82 12.07,10.42 11.7,10.05
  pour Top (no thermals): 6.4,17.92 4.11,17.92 4.11,14.37 5,14.37 5,17.03 5.13,17.16 5.51,17.54 6.4,17.54
VREF
  Bottom 0.305: U1.5 13.17,10.81 12.76,10.81 12.56,10.61 12.56,8.87 12,8.31 11.67,8.31 C1.1
  Bottom 0.61: C2.1 11.11,7.07 C1.1
VSSA  (via drill 0.3 pad 0.55)  (30 unrouted)
  Bottom 0.305: 9.83,10.05 10.62,10.84 11.39,10.84 12.36,11.82 U1.7
  other vias: 7.16,19.95 24.94,16.52 24.94,15.76 25.7,5.22 24.94,8.27 26.97,21.48 27.1,20.84 6.91,17.16 2.46,18.05
  pour Top (no thermals): 18.59,19.32 18.59,27.06 16.3,27.06 16.3,19.32
  pour Top (no thermals): 6.53,19.32 6.53,18.3 4.49,18.3 4.24,18.56 4.24,19.19 5.13,19.19 5.26,19.32
  pour Bottom (rank 6, no thermals): 8.68,29.99 25.96,29.99 33.33,17.18 25.71,3.95 9.56,3.95 1.62,17.72
  pour Top (rank 6, no thermals): 8.68,29.99 25.96,29.99 34.59,15 25.96,0.01 8.68,0.01 0.05,15
  pour Bottom (rank 4, no thermals): 18.21,6.87 18.21,5.86 18.21,5.35 18.21,5.09 19.86,5.09 19.86,3.95 19.86,3.19 25.83,3.19 25.83,4.71 25.83,5.6 25.83,8.52 18.21,8.52 18.21,7
  pour Top (rank 3, no thermals): 23.04,6.49 23.04,2.43 24.56,2.43 26.08,3.95 26.08,8.4 25.83,8.65 25.19,8.65 25.19,16.78 24.56,16.78 24.56,8.65 24.05,8.14 24.05,7.51
  pour Bottom (rank 3, no thermals): 10.21,6.36 10.21,10.3 5.13,15.38 5.13,16.27 4.11,16.27 4.11,15.13 9.06,10.17 9.06,6.49 9.19,6.36

### Text on the board
tPlace: P5* | P1 | 3V3 | 3V3 | P2* | P4 | 3V3 | P3 | 3V3
bPlace: LOAD | GND | VS | VS_Max=18V | Max_Current=20A | P1 | P5* | H0FR72 | GND | GND | P4 | P2* | GND | GND | P3
tNames: B | C | D